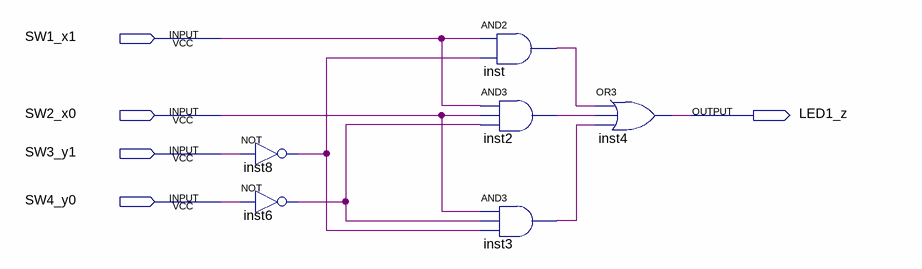
[diagram p0: schematic sheet]
// Quartus schematic q2.bdf as structural Verilog: 6 symbols, 5 pins
module q2 (
  input  SW1_x1,
  input  SW2_x0,
  input  SW3_y1,
  input  SW4_y0,
  output LED1_z
);

  wire inst2_out, inst3_out, inst6_out, inst8_out, inst_out;

  not inst8 (inst8_out, SW3_y1);
  not inst6 (inst6_out, SW4_y0);
  and inst (inst_out, SW1_x1, inst8_out);
  and inst2 (inst2_out, SW1_x1, SW2_x0, inst6_out);
  and inst3 (inst3_out, SW2_x0, inst6_out, inst8_out);
  or inst4 (LED1_z, inst_out, inst2_out, inst3_out);
endmodule
